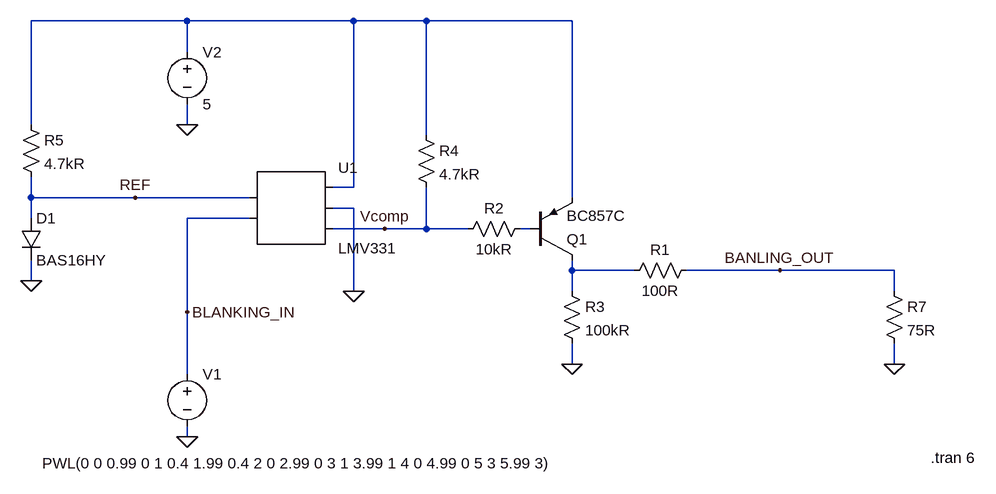
[diagram p0: schematic BLANKING_output_circuit.asc]
BLANKING_output_circuit.asc, the LTspice schematic file:
Version 4
SHEET 1 1620 876
WIRE -400 96 -640 96
WIRE -144 96 -400 96
WIRE -32 96 -144 96
WIRE 192 96 -32 96
WIRE -400 144 -400 96
WIRE -640 256 -640 96
WIRE -400 256 -400 224
WIRE -32 272 -32 96
WIRE -144 352 -144 96
WIRE -144 352 -176 352
WIRE -640 368 -640 336
WIRE -480 368 -640 368
WIRE -304 368 -480 368
WIRE 192 368 192 96
WIRE -144 384 -176 384
WIRE -640 400 -640 368
WIRE -304 400 -400 400
WIRE -96 416 -176 416
WIRE -32 416 -32 352
WIRE -32 416 -96 416
WIRE 32 416 -32 416
WIRE 128 416 112 416
WIRE 192 480 192 464
WIRE 288 480 192 480
WIRE 512 480 368 480
WIRE 688 480 512 480
WIRE -640 496 -640 464
WIRE -144 512 -144 384
WIRE 192 512 192 480
WIRE 688 512 688 480
WIRE -400 544 -400 400
WIRE 192 624 192 592
WIRE 688 624 688 592
WIRE -400 640 -400 544
WIRE -400 736 -400 720
FLAG -400 256 0
FLAG -400 544 BLANKING_IN
FLAG -400 736 0
FLAG 688 624 0
FLAG 512 480 BANLING_OUT
FLAG 192 624 0
FLAG -144 512 0
FLAG -640 496 0
FLAG -480 368 REF
FLAG -96 416 Vcomp
SYMBOL res 128 400 R90
WINDOW 0 0 56 VBottom 2
WINDOW 3 32 56 VTop 2
SYMATTR InstName R2
SYMATTR Value 10kR
SYMBOL voltage -400 128 R0
WINDOW 123 0 0 Left 0
WINDOW 39 0 0 Left 0
SYMATTR InstName V2
SYMATTR Value 5
SYMBOL voltage -400 624 R0
WINDOW 3 -223 153 Left 2
WINDOW 123 0 0 Left 0
WINDOW 39 0 0 Left 0
SYMATTR Value PWL(0 0 0.99 0 1 0.4 1.99 0.4 2 0 2.99 0 3 1 3.99 1 4 0 4.99 0 5 3 5.99 3)
SYMATTR InstName V1
SYMBOL res 672 496 R0
SYMATTR InstName R7
SYMATTR Value 75R
SYMBOL pnp 128 464 M180
SYMATTR InstName Q1
SYMATTR Value BC857C
SYMBOL res 384 464 R90
WINDOW 0 0 56 VBottom 2
WINDOW 3 32 56 VTop 2
SYMATTR InstName R1
SYMATTR Value 100R
SYMBOL res 176 496 R0
SYMATTR InstName R3
SYMATTR Value 100kR
SYMBOL AutoGenerated\\LMV331 -240 384 R0
SYMATTR InstName U1
SYMBOL res -48 256 R0
SYMATTR InstName R4
SYMATTR Value 4.7kR
SYMBOL diode -656 400 R0
SYMATTR InstName D1
SYMATTR Value BAS16HY
SYMBOL res -656 240 R0
SYMATTR InstName R5
SYMATTR Value 4.7kR
TEXT 744 768 Left 2 !.tran 6

The netlist it stands for:
* BLANKING_output_circuit.asc
R2 N002 Vcomp 10kR
V2 N001 0 5
V1 BLANKING_IN 0 PWL(0 0 0.99 0 1 0.4 1.99 0.4 2 0 2.99 0 3 1 3.99 1 4 0 4.99 0 5 3 5.99 3)
R7 BANLING_OUT 0 75R
Q1 N003 N002 N001 0 BC857C
R1 BANLING_OUT N003 100R
R3 N003 0 100kR
* U1: LMV331 (symbol AutoGenerated\LMV331 not available, pins judged from their places): pin1=REF pin2=BLANKING_IN pin3=N001 pin4=0 pin5=Vcomp
R4 N001 Vcomp 4.7kR
D1 REF 0 BAS16HY
R5 N001 REF 4.7kR
.model D D
.lib standard.dio
.model NPN NPN
.model PNP PNP
.lib standard.bjt
.tran 6
.backanno
.end